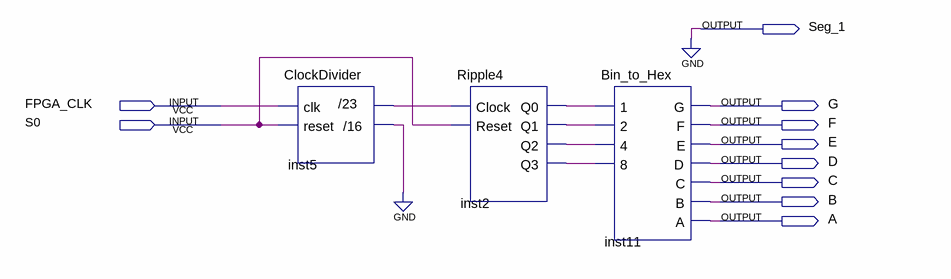
[diagram p0: schematic sheet]
// Quartus schematic Lab3.bdf as structural Verilog: 3 symbols, 10 pins
module Lab3 (
  input  FPGA_CLK,
  input  S0,
  output Seg_1,
  output G,
  output F,
  output E,
  output D,
  output C,
  output B,
  output A
);

  wire inst2_q0, inst2_q1, inst2_q2, inst2_q3, inst5__16, inst5__23;

  ClockDivider inst5 (.clk(FPGA_CLK), .reset(S0), .\/16 (inst5__16), .\/23 (inst5__23));
  Ripple4 inst2 (.Clock(inst5__23), .Reset(S0), .Q0(inst2_q0), .Q1(inst2_q1), .Q2(inst2_q2), .Q3(inst2_q3));
  Bin_to_Hex inst11 (
    .\8 (inst2_q3), .\4 (inst2_q2), .\2 (inst2_q1), .\1 (inst2_q0), .G(G), .F(F), .E(E), .D(D), .C(C), .B(B),
    .A(A));

  assign Seg_1 = 1'b0;
  // also tied to GND on the sheet: inst5__16
endmodule
